# EAGLE design communication-hub (EAGLE 8.4.1)
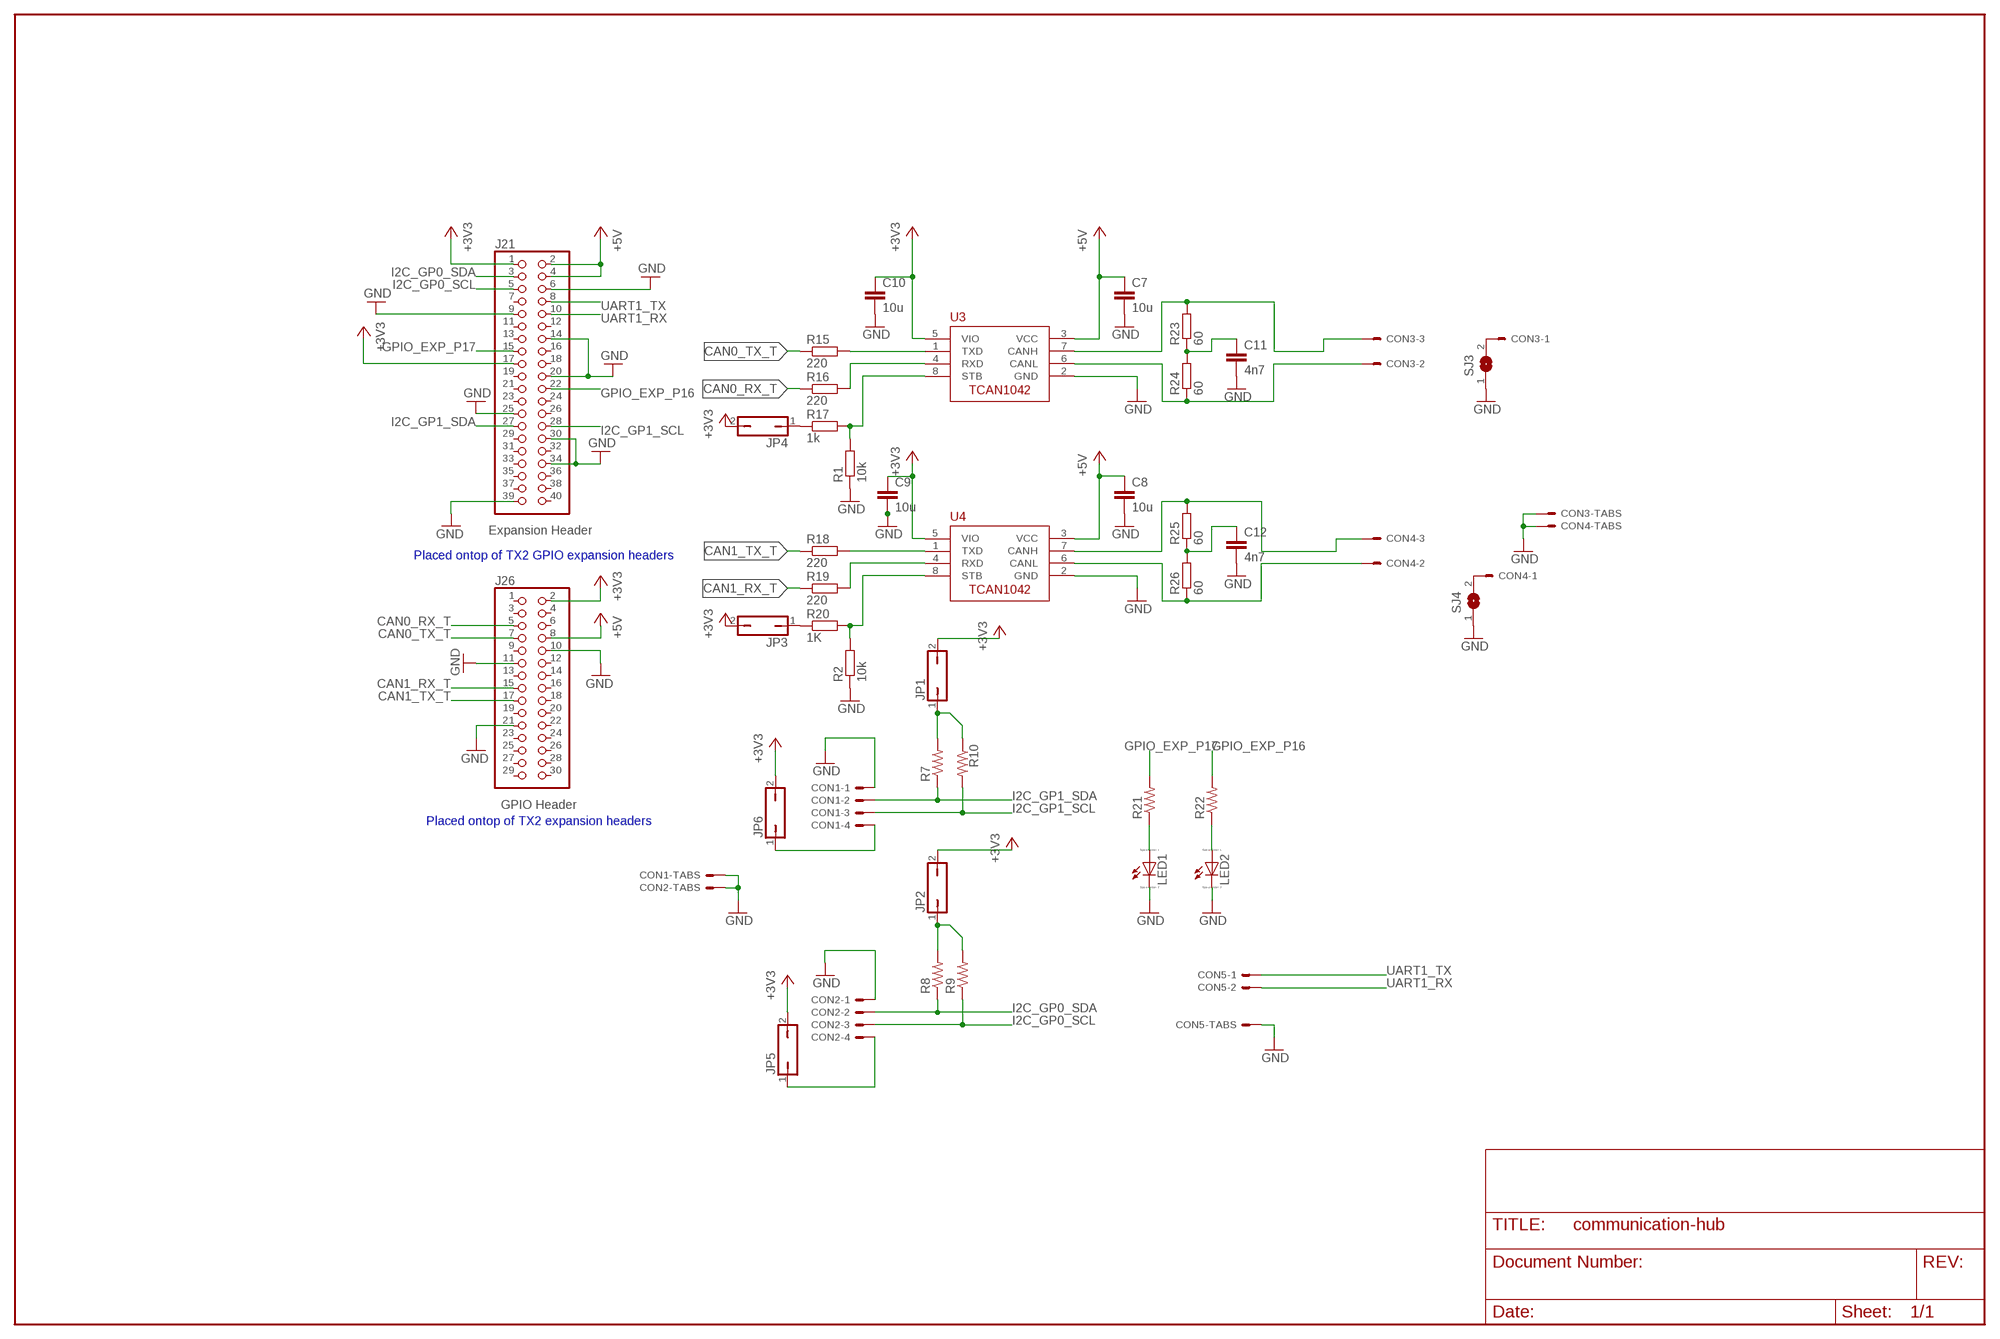
[diagram p0: schematic, sheet 1]

## Parts
C7  10u  C-EUC0805  [C0805]
C8  10u  C-EUC0805  [C0805]
C9  10u  C-EUC0805  [C0805]
C10  10u  C-EUC0805  [C0805]
C11  4n7  C-EUC0805  [C0805]
C12  4n7  C-EUC0805  [C0805]
CON1  SM04B-GHS-TB  [SM04B-GHS-TB]
CON2  SM04B-GHS-TB  [SM04B-GHS-TB]
CON3  SM03B-GHS-TB  [SM03B-GHS-TB]
CON4  SM03B-GHS-TB  [SM03B-GHS-TB]
CON5  SM02B-GHS-TB  [SM02B-GHS-TB]
J21  PINHD-2X20  [2X20]
J26  PINHD-2X15  [2X15]
JP1  JP1Q  [JP1]
JP2  JP1Q  [JP1]
JP3  JP1Q  [JP1]
JP4  JP1Q  [JP1]
JP5  JP1Q  [JP1]
JP6  JP1Q  [JP1]
LED1  LED_E  [LED_1206]
LED2  LED_E  [LED_1206]
R1  10k  R-EU_R0805  [R0805]
R2  10k  R-EU_R0805  [R0805]
R7  R-US_M1206  [M1206]
R8  R-US_M1206  [M1206]
R9  R-US_M1206  [M1206]
R10  R-US_M1206  [M1206]
R15  220  R-EU_R0805  [R0805]
R16  220  R-EU_R0805  [R0805]
R17  1k  R-EU_R0805  [R0805]
R18  220  R-EU_R0805  [R0805]
R19  220  R-EU_R0805  [R0805]
R20  1K  R-EU_R0805  [R0805]
R21  R-US_M1206  [M1206]
R22  R-US_M1206  [M1206]
R23  60  R-EU_R1206  [R1206]
R24  60  R-EU_R1206  [R1206]
R25  60  R-EU_R1206  [R1206]
R26  60  R-EU_R1206  [R1206]
SJ3  SJ  [SJ]
SJ4  SJ  [SJ]
U3  TCAN1042HVDR  [SO-8]
U4  TCAN1042HVDR  [SO-8]

## Nets
+3V3: C9.1 C10.1 J21.1 J21.17 J26.2 JP1.2 JP2.2 JP3.2 JP4.2 JP5.2 JP6.2 U3.5(VIO) U4.5(VIO)
+5V: C7.1 C8.1 J21.2 J21.4 J26.8 U3.3(VCC) U4.3(VCC)
CAN0_RX_T: J26.5 R16.1
CAN0_TX_T: J26.7 R15.1
CAN1_RX_T: J26.15 R19.1
CAN1_TX_T: J26.17 R18.1
GND: C7.2 C8.2 C9.2 C10.2 C11.2 C12.2 CON1.P$1 CON1.P$5 CON1.P$6 CON2.P$1 CON2.P$5 CON2.P$6 CON3.P$4 CON3.P$5 CON4.P$4 CON4.P$5 CON5.P$3 CON5.P$4 J21.6 J21.9 J21.14 J21.20 J21.25 J21.30 J21.34 J21.39 J26.10 J26.11 J26.21 LED1.C LED2.C R1.1 R2.1 SJ3.1 SJ4.1 U3.2(GND) U4.2(GND)
GPIO_EXP_P16: J21.22 R22.2
GPIO_EXP_P17: J21.15 R21.2
I2C_GP0_SCL: CON2.P$3 J21.5 R9.1
I2C_GP0_SDA: CON2.P$2 J21.3 R8.1
I2C_GP1_SCL: CON1.P$3 J21.28 R10.2
I2C_GP1_SDA: CON1.P$2 J21.27 R7.1
N$1: JP2.1 R8.2 R9.2
N$2: JP1.1 R7.2 R10.1
N$3: LED1.A R21.1
N$4: LED2.A R22.1
N$5: CON1.P$4 JP6.1
N$6: CON2.P$4 JP5.1
N$19: C11.1 R23.1 R24.2
N$20: C12.1 R25.1 R26.2
N$21: CON4.P$3 R25.2 U4.7(CANH)
N$22: CON4.P$2 R26.1 U4.6(CANL)
N$23: CON3.P$3 R23.2 U3.7(CANH)
N$24: CON3.P$2 R24.1 U3.6(CANL)
N$25: R15.2 U3.1(TXD)
N$26: R16.2 U3.4(RXD)
N$27: R1.2 R17.2 U3.8(STB)
N$28: R18.2 U4.1(TXD)
N$29: R19.2 U4.4(RXD)
N$30: R2.2 R20.2 U4.8(STB)
N$31: CON3.P$1 SJ3.2
N$32: CON4.P$1 SJ4.2
N$33: JP4.1 R17.1
N$34: JP3.1 R20.1
UART1_RX: CON5.P$2 J21.10
UART1_TX: CON5.P$1 J21.8
Unconnected: J21.7 J21.11 J21.12 J21.13 J21.16 J21.18 J21.19 J21.21 J21.23 J21.24 J21.26 J21.29 J21.31 J21.32 J21.33 J21.35 J21.36 J21.37 J21.38 J21.40 J26.1 J26.3 J26.4 J26.6 J26.9 J26.12 J26.13 J26.14 J26.16 J26.18 J26.19 J26.20 J26.22 J26.23 J26.24 J26.25 J26.26 J26.27 J26.28 J26.29 J26.30

## Notes on the sheet
- Expansion Header
- Placed ontop of TX2 GPIO expansion headers
- GPIO Header
- Placed ontop of TX2 expansion headers

## Library data of the parts
C7-C12 = resistor:C-EU: CAPACITOR, European symbol
CON1 CON2 = ARVP:SM04B-GHS-TB
CON3 CON4 = ARVP:SM03B-GHS-TB
CON5 = ARVP:SM02B-GHS-TB
J21 = commhub:PINHD-2X20: PIN HEADER
J26 = commhub:PINHD-2X15: PIN HEADER
JP1-JP6 = jumper:JP1Q: JUMPER
LED1 LED2 = eagle-ltspice:LED_E: LED Source: http://www.osram.convergy.de Source: www.luxeon.com Source: www.kingbright.com; SPICEMODEL: NONE; SPICEPREFIX: D; SPICETYPE: diode
R1 R2 R15-R20 R23-R26 = resistor:R-EU_: RESISTOR, European symbol
R7-R10 R21 R22 = resistor:R-US_: RESISTOR, American symbol
SJ3 SJ4 = jumper:SJ: SMD solder JUMPER
U3 U4 = ARVP:TCAN1042HVDR

## Board
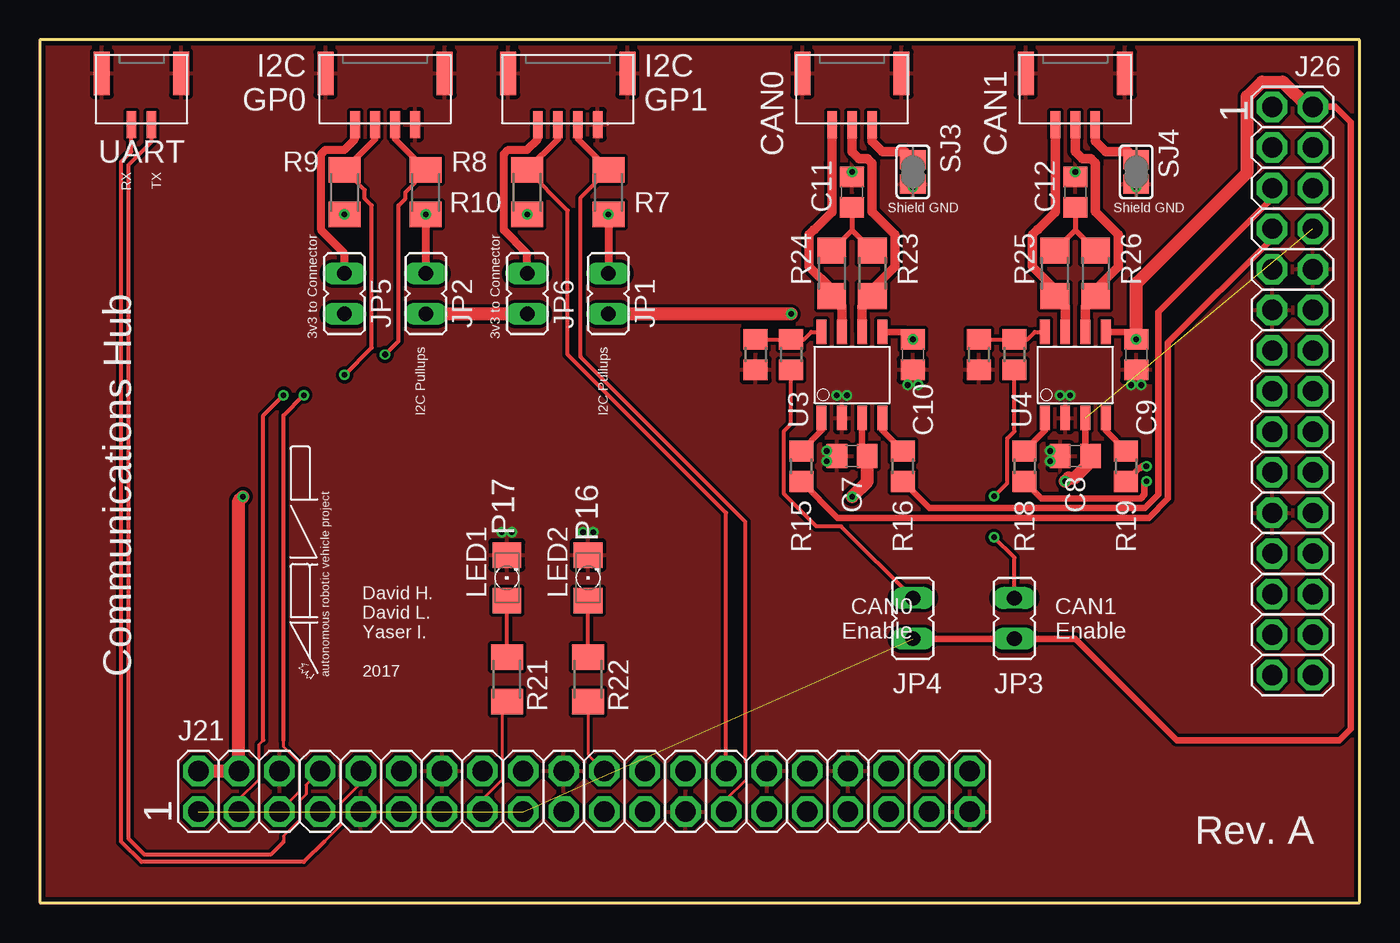
[diagram p1: board, top side]
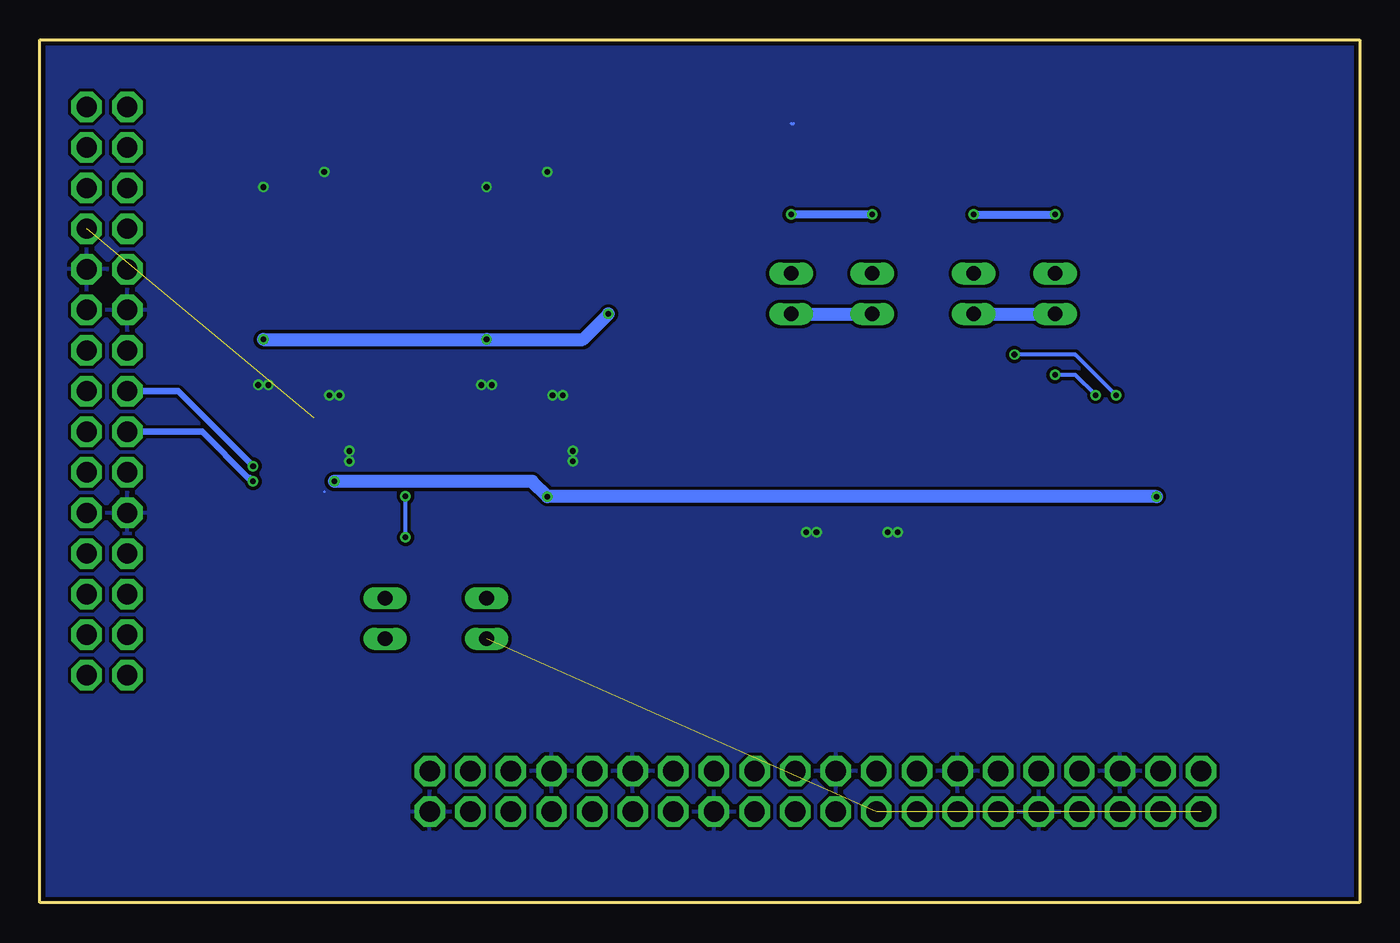
[diagram p2: board, bottom side, seen from below]

Size 82.55 x 53.98 mm. Coordinates in mm from the lower left corner, seen from the top.
Outline: 0,0 82.55,0 82.55,53.98 0,53.98 0,0
Copper layers (1*16): Top 0.035mm / dielectric 1.5mm / Bottom 0.035mm
Design rules "ITEADstudioDRC *": minimum track width 6mil, minimum drill 12mil, track to track 8mil, track to pad 8mil, pad to pad 8mil, via to via 8mil, smd to smd 0mil, copper to edge 10mil, drill to drill 10mil, minimum pad ring 6mil, minimum via ring 6mil, stop-mask expansion 2mil, vias tented up to drill 100mil, thermal gap 10mil

### Footprints (pad centres in the part's own frame; a part is rotated, then mirrored left to right if it is on the bottom)
C0805 = smd 1.3 x 1.5: 1 -0.95,0; 2 0.95,0
SM04B-GHS-TB = smd 0.6 x 1.7: P$1 -1.875,0.85; P$2 -0.625,0.85; P$3 0.625,0.85; P$4 1.875,0.85 | smd 1 x 2.7: P$5 -3.725,-2.35; P$6 3.725,-2.35
SM03B-GHS-TB = smd 0.6 x 1.7: P$1 -1.25,0.85; P$2 0,0.85; P$3 1.25,0.85 | smd 1 x 2.7: P$4 -3.1,-2.35; P$5 3.1,-2.35
SM02B-GHS-TB = smd 0.6 x 1.7: P$1 -0.625,0.85; P$2 0.625,0.85 | smd 1 x 2.7: P$3 -2.475,-2.35; P$4 2.475,-2.35
2X20 = drill 1.27 octagon: 1 -24.13,-1.27; 2 -24.13,1.27; 3 -21.59,-1.27; 4 -21.59,1.27; 5 -19.05,-1.27; 6 -19.05,1.27; 7 -16.51,-1.27; 8 -16.51,1.27; 9 -13.97,-1.27; 10 -13.97,1.27; 11 -11.43,-1.27; 12 -11.43,1.27; 13 -8.89,-1.27; 14 -8.89,1.27; 15 -6.35,-1.27; 16 -6.35,1.27; 17 -3.81,-1.27; 18 -3.81,1.27; 19 -1.27,-1.27; 20 -1.27,1.27; 21 1.27,-1.27; 22 1.27,1.27; 23 3.81,-1.27; 24 3.81,1.27; 25 6.35,-1.27; 26 6.35,1.27; 27 8.89,-1.27; 28 8.89,1.27; 29 11.43,-1.27; 30 11.43,1.27; 31 13.97,-1.27; 32 13.97,1.27; 33 16.51,-1.27; 34 16.51,1.27; 35 19.05,-1.27; 36 19.05,1.27; 37 21.59,-1.27; 38 21.59,1.27; 39 24.13,-1.27; 40 24.13,1.27
2X15 = drill 1.27 octagon: 1 -17.78,-1.27; 2 -17.78,1.27; 3 -15.24,-1.27; 4 -15.24,1.27; 5 -12.7,-1.27; 6 -12.7,1.27; 7 -10.16,-1.27; 8 -10.16,1.27; 9 -7.62,-1.27; 10 -7.62,1.27; 11 -5.08,-1.27; 12 -5.08,1.27; 13 -2.54,-1.27; 14 -2.54,1.27; 15 0,-1.27; 16 0,1.27; 17 2.54,-1.27; 18 2.54,1.27; 19 5.08,-1.27; 20 5.08,1.27; 21 7.62,-1.27; 22 7.62,1.27; 23 10.16,-1.27; 24 10.16,1.27; 25 12.7,-1.27; 26 12.7,1.27; 27 15.24,-1.27; 28 15.24,1.27; 29 17.78,-1.27; 30 17.78,1.27
JP1 = drill 0.914 long: 1 0,-1.27; 2 0,1.27
LED_1206 = smd 1.6 x 1.803: A -1.422,0; C 1.422,0
R0805 = smd 1.3 x 1.5: 1 -0.95,0; 2 0.95,0
M1206 = smd 1.6 x 2: 1 -1.4,0; 2 1.4,0
R1206 = smd 1.6 x 1.803: 1 -1.422,0; 2 1.422,0
SJ = smd 1.168 x 1.6: 1 -0.762,0; 2 0.762,0
SO-8 = smd 1.524 x 0.61: 1 -2.692,1.905; 2 -2.692,0.635; 3 -2.692,-0.635; 4 -2.692,-1.905; 5 2.692,-1.905; 6 2.692,-0.635; 7 2.692,0.635; 8 2.692,1.905

### Placement (x,y rotation side)
C7  50.8,27.94 180 top
C8  64.77,27.94 180 top
C9  68.58,34.29 270 top
C10  54.61,34.29 270 top
C11  50.8,44.45 90 top
C12  64.77,44.45 90 top
CON1  33.02,49.53 180 top
CON2  21.59,49.53 180 top
CON3  50.8,49.53 180 top
CON4  64.77,49.53 180 top
CON5  6.35,49.53 180 top
J21  34.04,6.96 0 top
J26  78.36,32 270 top
JP1  35.56,38.1 180 top
JP2  24.13,38.1 180 top
JP3  60.96,17.78 180 top
JP4  54.61,17.78 180 top
JP5  19.05,38.1 180 top
JP6  30.48,38.1 180 top
LED1  29.21,20.32 90 top
LED2  34.29,20.32 90 top
R1  44.77,34.29 90 top
R2  58.74,34.29 90 top
R7  35.56,44.45 270 top
R8  24.13,44.45 270 top
R9  19.05,44.45 270 top
R10  30.48,44.45 90 top
R15  47.62,27.3 90 top
R16  53.98,27.3 90 top
R17  46.99,34.29 90 top
R18  61.59,27.3 90 top
R19  67.94,27.3 90 top
R20  60.96,34.29 90 top
R21  29.21,13.97 270 top
R22  34.29,13.97 270 top
R23  49.53,39.37 270 top
R24  52.07,39.37 90 top
R25  63.5,39.37 270 top
R26  66.04,39.37 90 top
SJ3  54.61,45.72 90 top
SJ4  68.58,45.72 90 top
U3  50.8,33.02 90 top
U4  64.77,33.02 90 top
U$1  [ARVP]  18.1,14.13 90 top
U$2  [LETTER_P]  -52.07,-114.3 0 top  (outside the outline)
U$3  [DOCFIELD]  31.75,-114.3 0 top  (outside the outline)

### Tracks (layer width: path | path; a pad name or v marks a point on that pad's centre or on a via)
+3V3  (via drill 0.35)  (2 unrouted)
  Top 0.406: C10.1 54.14,35.71 U3.5 | C9.1 68.11,35.71 U4.5 | J26.2 81.03,49.78 81.99,48.82 81.99,10.87 81.28,10.16 71.12,10.16 64.77,16.51 JP3.2 JP4.2
  Top 0.813: v46.99,36.83 JP1.2 | JP6.2 JP2.2 | C9.1 68.58,38.73 75.53,45.68 75.53,50.43 76.44,51.35 77.74,51.35 79.3,49.78 J26.2
  Bottom 0.813: C9.1 C10.1 48.58,35.24 v46.99,36.83 | JP1.2 JP6.2 | JP2.2 JP5.2
  other vias: 68.58,35.24 54.61,35.24
+5V  (via drill 0.35)  (1 unrouted)
  Top 0.406: C8.1 65.41,28.25 U4.3 | C7.1 51.44,28.25 U3.3
  Top 0.813: J21.2 J21.4 12.45,25.15 v12.7,25.4 | v50.8,25.4 51.75,26.35 C7.1 | v64.14,26.35 64.36,26.58 64.72,26.58 65.72,27.58 C8.1
  Bottom 0.813: v12.7,25.4 v50.8,25.4 51.76,26.36 60.08,26.36 60.09,26.35 v64.14,26.35
CAN0_RX_T
  Top 0.406: J26.5 77.09,44.09 69.96,36.96 69.96,25.53 69.12,24.69 55.64,24.69 R16.1
CAN0_TX_T
  Top 0.406: J26.7 77.09,41.55 70.57,35.03 70.57,25.28 69.37,24.08 49.9,24.08 R15.1
CAN1_RX_T  (via drill 0.35)
  Top 0.406: v69.22,27.3 68.97,27.3 68.86,27.2 68.79,27.2 R19.1
  Bottom 0.406: J26.15 73.91,32 v69.22,27.3
CAN1_TX_T  (via drill 0.35)
  Top 0.406: v69.23,26.35 69.1,26.23 69.1,25.54 68.86,25.3 62.65,25.3 R18.1
  Bottom 0.406: v69.23,26.35 69.44,26.57 69.52,26.57 72.41,29.46 J26.17
GND  (via drill 0.35)
  Top 0.203: 35.51,48.68 35.56,48.74
  Bottom 0.203: 35.56,48.74 35.4,48.74 | 64.77,25.72
  other vias: 64.77,45.72 50.8,45.72 54.93,32.38 54.29,32.38 68.26,32.38 68.9,32.38 49.21,28.26 49.21,27.62 63.18,28.26 63.18,27.62 63.82,31.75 64.45,31.75 49.85,31.75 50.48,31.75 54.61,44.77 68.58,44.77 33.97,23.18 34.61,23.18 28.89,23.18 29.53,23.18
  pour Top: 83.55,54.88 -0.82,54.88 -0.82,-0.82 83.55,-0.82
  pour Bottom: 83.55,54.88 -0.82,54.88 -0.82,-0.82 83.55,-0.82
GPIO_EXP_P16
  Top 0.203: R22.2 34.29,9.25 J21.22
GPIO_EXP_P17
  Top 0.203: J21.15 27.69,6.45 28.94,7.71 28.94,12.3 R21.2
I2C_GP0_SCL  (via drill 0.35)
  Top 0.203: 15.24,10.16 15.24,9.75 16.24,8.75 16.24,6.95 J21.5
  Top 0.254: 15.24,10.16 15.24,30.48 v16.51,31.75 | v19.05,33.02 20.75,34.72 20.75,43.62 20.32,44.05 20.32,44.58 R9.1
  Top 0.406: R9.1 20.96,47.77 CON2.P$3
  Bottom 0.254: v16.51,31.75 17.78,33.02 v19.05,33.02
I2C_GP0_SDA  (via drill 0.35)
  Top 0.203: J21.3 12.45,6.45 13.7,7.71 13.7,9.89 13.97,10.16
  Top 0.254: 13.97,10.16 13.97,30.48 v15.24,31.75 | v21.59,34.29 22.43,35.13 22.43,43.62 22.86,44.05 22.86,44.45 24.13,45.72 R8.1
  Top 0.406: R8.1 22.21,47.77 CON2.P$2
  Bottom 0.254: v15.24,31.75 17.78,34.29 v21.59,34.29
I2C_GP1_SCL
  Top 0.254: J21.28 42.93,24.38 33.02,34.29 33.02,43.31 R10.2
  Top 0.406: R10.2 32.4,47.77 CON1.P$3
I2C_GP1_SDA
  Top 0.203: J21.27 42.93,6.45 44.18,7.71 44.18,8.75 44.13,8.8 44.13,9.21
  Top 0.254: 44.13,9.21 44.13,23.82 33.82,34.14 33.82,44.11 R7.1
  Top 0.406: R7.1 33.66,47.76 33.66,47.94 33.65,47.95 CON1.P$2
N$1  (via drill 0.35)
  Top 0.508: R8.2 JP2.1
  Bottom 0.508: R8.2 R9.2
  other vias: 24.13,43.05 19.05,43.05
N$2  (via drill 0.35)
  Top 0.508: R7.2 JP1.1
  Bottom 0.508: R10.1 R7.2
  other vias: 30.48,43.05 35.56,43.05
N$3
  Top 0.254: R21.1 LED1.A
N$4
  Top 0.254: R22.1 LED2.A
N$5
  Top 0.508: JP6.1 30.48,40.6 29.02,42.06 29.02,46.84 29.29,47.11 30.48,47.11 31.14,47.77 CON1.P$4
N$6
  Top 0.508: JP5.1 19.05,40.6 17.59,42.06 17.59,46.84 17.86,47.11 19.05,47.11 19.71,47.77 CON2.P$4
N$19
  Top 0.305: C11.1 50.8,42.06 | 50.8,42.06 R24.2 | 50.8,42.06 R23.1
N$20
  Top 0.305: C12.1 64.77,42.06 | 64.77,42.06 R26.2 | 64.77,42.06 R25.1
N$21
  Top 0.61: U4.7 64.14,37.31 R25.2 63.5,38.37 62.09,39.78 62.09,41.8 62.39,42.1 62.42,42.1 63.51,43.19 | CON4.P$3 63.52,46.27 63.51,46.26 63.51,43.19 | 63.5,43.18 63.51,43.19
N$22
  Top 0.61: U4.6 65.41,37.31 R26.1 66.04,38.37 67.45,39.78 67.45,41.8 66.03,43.22 66.03,46.26 65.73,46.56 65.2,46.56 64.77,46.99 CON4.P$2
N$23
  Top 0.61: U3.7 50.16,37.31 R23.2 49.53,38.37 48.12,39.78 48.12,41.8 48.42,42.1 48.45,42.1 49.54,43.19 49.54,46.26 49.55,46.27 CON3.P$3
N$24
  Top 0.61: U3.6 51.44,37.31 R24.1 52.07,38.37 53.48,39.78 53.48,41.8 52.06,43.22 52.06,46.26 51.76,46.56 51.23,46.56 50.8,46.99 CON3.P$2
N$25
  Top 0.406: R15.2 48.9,29.52 U3.1
N$26
  Top 0.406: R16.2 52.7,29.52 U3.4
N$27
  Top 0.254: R1.2 R17.2 47.79,35.24 48.26,35.71 U3.8
N$28
  Top 0.406: R18.2 62.87,29.52 U4.1
N$29
  Top 0.406: R19.2 66.67,29.52 U4.4
N$30
  Top 0.254: R2.2 R20.2 61.76,35.24 62.23,35.71 U4.8
N$31
  Top 0.61: SJ3.2 54.1,46.99 52.7,46.99 52.05,47.65 CON3.P$1
N$32
  Top 0.61: SJ4.2 68.07,46.99 66.67,46.99 66.02,47.65 CON4.P$1
N$33
  Top 0.254: JP4.1 50.11,23.55 48.57,23.55 46.55,25.57 46.55,29.51 46.99,29.96 R17.1
N$34  (via drill 0.35)
  Top 0.254: JP3.1 60.96,21.59 v59.69,22.86 | v59.69,25.42 60.52,26.25 60.52,29.04 60.96,29.49 R20.1
  Bottom 0.254: v59.69,22.86 v59.69,25.42
UART1_RX
  Top 0.203: J21.10 20.07,7.47 18.81,6.21 18.81,4.84 17.78,3.81
  Top 0.254: 17.78,3.81 16.51,2.54 6.35,2.54 5.08,3.81 5.08,46.35 5.71,46.99 CON5.P$2
UART1_TX
  Top 0.203: J21.8 16.65,7.35 16.65,6.78 16.24,6.37 16.24,5.17 15.24,4.17 15.24,3.81
  Top 0.254: 15.24,3.81 14.43,3 6.54,3 5.54,4 5.54,46.17 6.97,47.6 CON5.P$1

### Text on the board
tNames: 1 | 1
tSilk: CAN0 | CAN1 | I2C / GP0 | I2C / GP1 | UART | RX | TX | Shield GND | Shield GND | 3v3 to Connector | I2C Pullups | 3v3 to Connector | I2C Pullups | P16 | P17 | CAN0 / Enable | CAN1 / Enable | David H. / David L. / Yaser I. | Communications Hub | 2017 | Rev. A